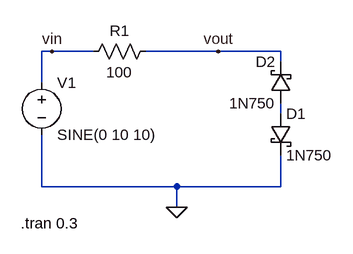
[diagram p0: schematic 1.2.asc]
1.2.asc, the LTspice schematic file:
Version 4
SHEET 1 880 680
WIRE -112 0 -128 0
WIRE -48 0 -112 0
WIRE 144 0 32 0
WIRE 240 0 144 0
WIRE 240 16 240 0
WIRE -128 48 -128 0
WIRE 240 96 240 80
WIRE -128 208 -128 128
WIRE 80 208 -128 208
WIRE 240 208 240 160
WIRE 240 208 80 208
WIRE 80 240 80 208
FLAG 80 240 0
FLAG 144 0 vout
FLAG -112 0 vin
SYMBOL schottky 256 80 R180
WINDOW 0 24 64 Left 2
WINDOW 3 24 0 Left 2
SYMATTR InstName D2
SYMATTR Value 1N750
SYMATTR Description Zener Diode
SYMATTR Type zener
SYMBOL res 48 -16 R90
WINDOW 0 0 56 VBottom 2
WINDOW 3 32 56 VTop 2
SYMATTR InstName R1
SYMATTR Value 100
SYMBOL voltage -128 32 R0
WINDOW 123 0 0 Left 0
WINDOW 39 0 0 Left 0
SYMATTR InstName V1
SYMATTR Value SINE(0 10 10)
SYMBOL schottky 224 96 R0
SYMATTR InstName D1
SYMATTR Value 1N750
SYMATTR Description Zener Diode
SYMATTR Type zener
TEXT -160 264 Left 2 !.tran 0.3

The netlist it stands for:
* 1.2.asc
D2 N001 vout 1N750
R1 vout vin 100
V1 vin 0 SINE(0 10 10)
D1 N001 0 1N750
.model D D
.lib standard.dio
.tran 0.3
.backanno
.end